# Altium schematic sheet KeeWatch_Sensors.SchDoc
size Letter
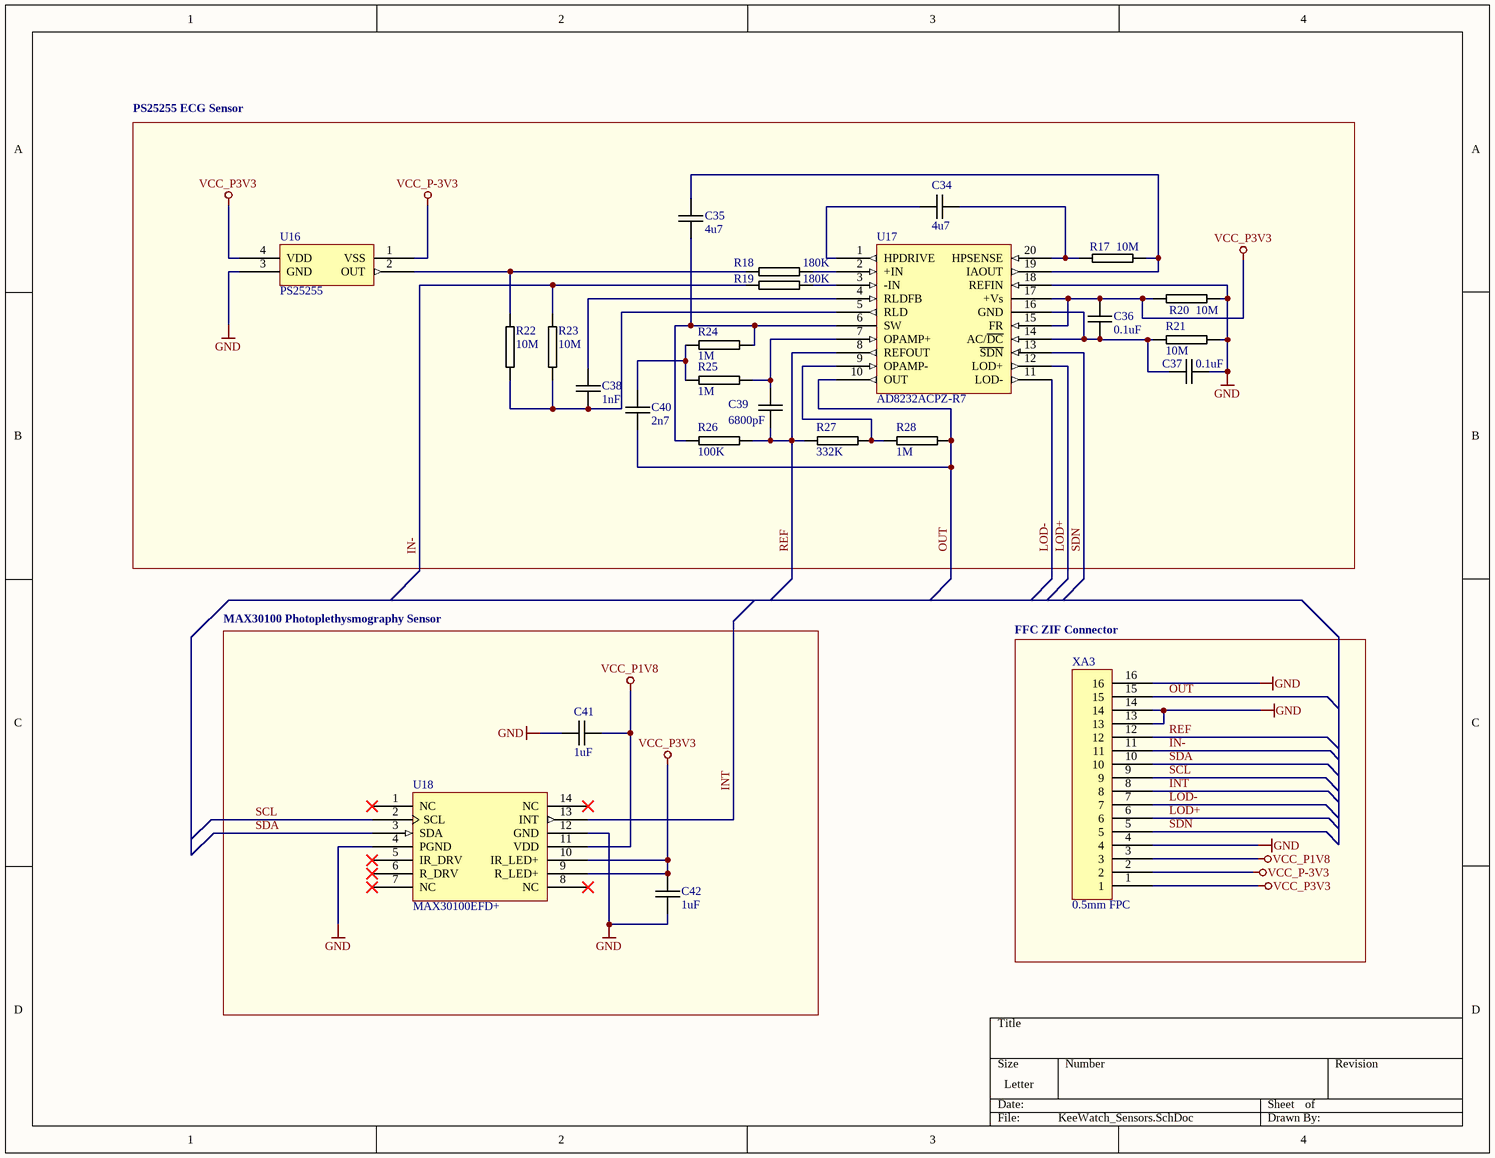
[diagram p0: KeeWatch_Sensors.SchDoc]

## Parts
C34  4u7  [0402C-GENERIC]
C35  4u7  [0402C-GENERIC]
C36  0.1uF  [0603C-GENERIC]
C37  0.1uF  [0603C-GENERIC]
C38  1nF  [0603C-GENERIC]
C39  6800pF  [0603C-GENERIC]
C40  2n7  [0603C-GENERIC]
C41  1uF  [0603C-GENERIC]
C42  1uF  [0603C-GENERIC]
R17  10M  [0603R-GENERIC]
R18  180K  [0603R-180K]
R19  180K  [0603R-180K]
R20  10M  [0603R-GENERIC]
R21  10M  [0603R-GENERIC]
R22  10M  [0603R-GENERIC]
R23  10M  [0603R-GENERIC]
R24  1M  [0603R-GENERIC]
R25  1M  [0603R-GENERIC]
R26  100K  [0603R-100K]
R27  332K  [0603R-330K]
R28  1M  [0603R-GENERIC]
U16  PS25255  [PS25255]
U17  AD8232ACPZ-R7  [LFCSP_WQ20]
U18  MAX30100EFD+  [14OESIP]
XA3  0.5mm FPC  [16-PIN CONNECTOR]

## Blocks framed on the sheet
PS25255 ECG Sensor: C34-C40 R17-R28 U16 U17
MAX30100 Photoplethysmography Sensor: C41 C42 U18
FFC ZIF Connector: XA3

## Nets
GND: C37.2 C41.1 C42.1 R20.2 R21.2 U16.3(GND) U17.18(REFIN) U18.4(PGND) U18.12(GND) XA3.4 XA3.13 XA3.14 XA3.16
VCC_P1V8: C41.2 U18.11(VDD) XA3.3
VCC_P3V3: C36.1 C42.2 R20.1 U16.4(VDD) U17.15(FR) U17.17(+Vs) U18.9(R_LED+) U18.10(IR_LED+) XA3.1
VCC_P-3V3: U16.1(VSS) XA3.2
IN-: R19.1 R23.2 XA3.11
INT: U18.13(INT) XA3.8
LOD+: U17.12(LOD+) XA3.6
LOD-: U17.11(LOD-) XA3.7
OUT: C40.2 R28.1 U17.10(OUT) XA3.15
REF: C39.2 R26.2 R27.2 U17.8(REFOUT) XA3.12
SCL: U18.2(SCL) XA3.9
SDA: U18.3(SDA) XA3.10
SDN: U17.13(~{SDN}) XA3.5
NetC34_1: C34.1 U17.1(HPDRIVE)
NetC34_2: C34.2 R17.1 U17.20(HPSENSE)
NetC35_1: C35.1 R24.1 R26.1 U17.6(SW)
NetC35_2: C35.2 R17.2 U17.19(IAOUT)
NetC36_2: C36.2 C37.1 R21.1 U17.14(AC/~{DC}) U17.16(GND)
NetC38_1: C38.1 U17.4(RLDFB)
NetC38_2: C38.2 R22.1 R23.1 U17.5(RLD)
NetC39_1: C39.1 R25.2 U17.7(OPAMP+)
NetC40_1: C40.1 R24.2 R25.1
NetR18_1: R18.1 R22.2 U16.2(OUT)
NetR18_2: R18.2 U17.2(+IN)
NetR19_2: R19.2 U17.3(-IN)
NetR27_1: R27.1 R28.2 U17.9(OPAMP-)

Not connected (* = marked no-connect by the designer): U18 1(NC)* 5(IR_DRV)* 6(R_DRV)* 7(NC)* 8(NC)* 14(NC)*

## Library data of the parts
C34 C35 = 0402C-4U7-10V-X5R-SAM: CAPACITOR 0402 CERAMIC; Reel: C48
C36 C37 C41 C42 = 0603C-1UF-10V-X5R-TDK: CAPACITOR 0603 CERAMIC; Manufacturer: TDK Corporation; Manufacturer Part Number: C1608X5R1A105K; Reel: C23; Supplier 1: Digi-Key; Supplier Part Number 1: 445-1321-2-ND
C38 = 0603C-1NF-50V-X7R: CAPACITOR 0603 CERAMIC
C39 = 0603C-3900pF: CAPACITOR 0603 CERAMIC; REEL: C71; Supplier 1: Digi-Key; Supplier Part Number 1: PCC1779DKR-ND
C40 = 0603C-4P7-50V-NP0: CAPACITOR 0603 CERAMIC
R17 R20-R23 = 0603R-10M: GENERIC RESISTOR 0603; Manufacturer Part Number: RMCF 1/16 10M 5% R; Manufacturer: Stackpole Electronics Inc; Reel: R15; Tolerance: ±5%; Temperature Coefficient: ±350ppm/°C; Power (Watts): 0.1W, 1/10W; Resistance In Ohms: 10.0M; Packaging: Tape & Reel (TR); Lead Style: Surface Mount (SMD - SMT); Case: 0603 (1608 metric); Features: -; Composition: Thick Film; RoHS: RoHS Compliant; Supplier: Digi-Key; Supplier Part Number: RMCF1/1610MJRTR-ND; Category: Resistors; Supplier 1: Digi-Key; Supplier Part Number 1: RMCF0603FT10M0DKR-ND
R18 R19 = 0603R-180K: GENERIC RESISTOR 0603; Manufacturer Part Number: RMC 1/16 180K 1% R; Manufacturer: Stackpole Electronics Inc; Temperature Coefficient: ±100ppm/°C; Power (Watts): 0.1W, 1/10W; Tolerance: ±1%; Supplier 1: Digi-Key; Supplier Part Number 1: RMC1/16180KFR-ND; Packaging: Tape & Reel (TR); Category: Resistors; Lead Style: Surface Mount (SMD - SMT); Supplier: Digi-Key; Composition: Thick Film; Supplier Part Number: RMC1/16180KFR-ND; Case: 0603 (1608 metric); Resistance In Ohms: 180K; RoHS: RoHS non-compliant
R24 R25 R28 = 0603R-1M: GENERIC RESISTOR 0603; Manufacturer: Stackpole Electronics Inc; Manufacturer Part Number: RMCF 1/16 1M 1% R; Power (Watts): 0.1W, 1/10W; Temperature Coefficient: ±100ppm/°C; Resistance In Ohms: 1.00M; Tolerance: ±1%; REEL: R51; Supplier: Digi-Key; Supplier Part Number: RMCF1/161MFRTR-ND; Category: Resistors; Lead Style: Surface Mount (SMD - SMT); Case: 0603 (1608 metric); RoHS: RoHS Compliant; Composition: Thick Film; Packaging: Tape & Reel (TR); Supplier 1: Digi-Key; Supplier Part Number 1: RMCF0603FT1M00TR-ND
R26 = 0603R-100K: GENERIC RESISTOR 0603; Manufacturer Part Number: RMCF 1/16 100K 1% R; Manufacturer: Stackpole Electronics Inc; Tolerance: ±1%; Power (Watts): 0.1W, 1/10W; Temperature Coefficient: ±100ppm/°C; REEL: R47; Case: 0603 (1608 metric); Resistance In Ohms: 100K; RoHS: RoHS Compliant; Composition: Thick Film; Lead Style: Surface Mount (SMD - SMT); Supplier: Digi-Key; Supplier Part Number: RMCF1/16100KFRCT-ND; Category: Resistors; Packaging: Cut Tape (CT); Supplier 1: Digi-Key; Supplier Part Number 1: RMCF0603FT100KTR-ND
R27 = 0603R-330K: GENERIC RESISTOR 0603; Manufacturer: Stackpole Electronics Inc; Manufacturer Part Number: RMCF 1/16 330K 1% R; Resistance In Ohms: 330K; Temperature Coefficient: ±100ppm/°C; Power (Watts): 0.1W, 1/10W; Tolerance: ±1%; Supplier 1: Digi-Key; Supplier Part Number 1: RMCF1/16330KFRCT-ND; Supplier Part Number: RMCF1/16330KFRCT-ND; Packaging: Cut Tape (CT); RoHS: RoHS Compliant; Composition: Thick Film; Supplier: Digi-Key; Lead Style: Surface Mount (SMD - SMT); Category: Resistors; Case: 0603 (1608 metric)
U16 = PS25255: EPIC Ultra High Impedance ECG Senso
U17 = AD8232ACPZ-R7: Single-Lead, Heart Rate Monitor Front End
U18 = MAX30100EFD+: Pulse Oximeter and Heart-Rate Sensor IC for Wearable Health
XA3 = 0.5mm FPC: 0.5mm FPC 16-pin Connector